# EAGLE design master (EAGLE 9.6.2)
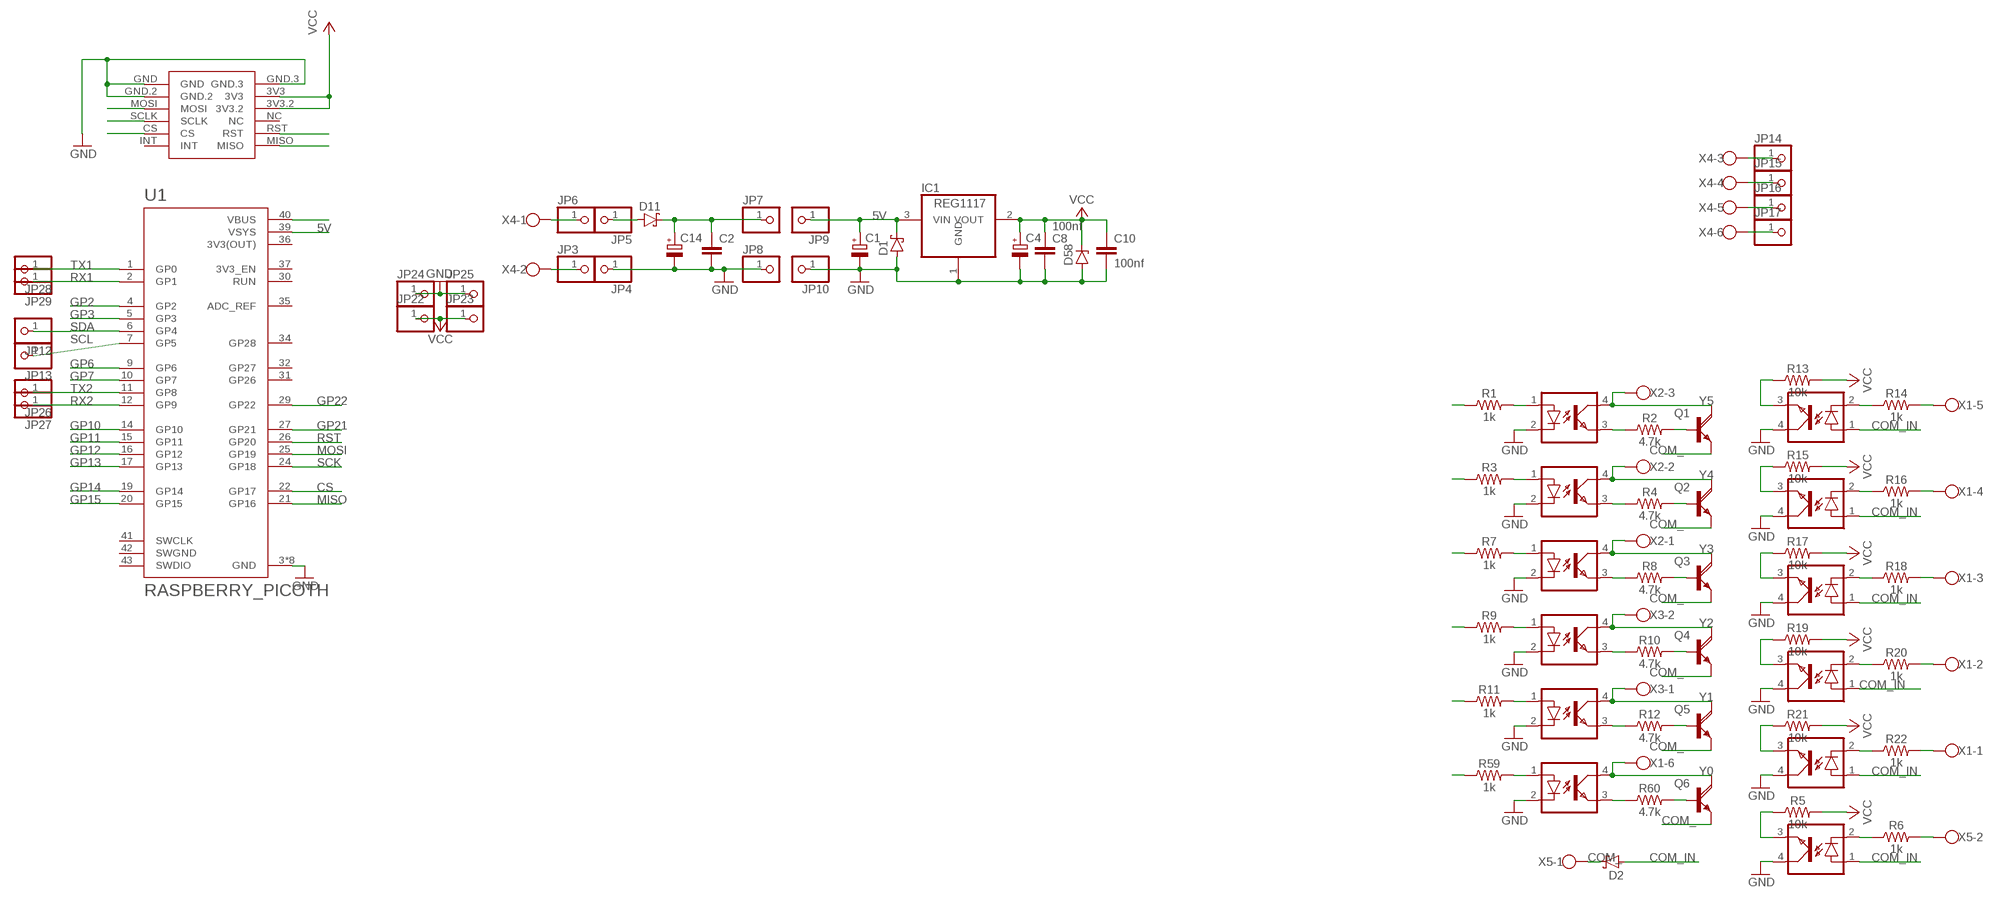
[diagram p0: schematic, sheet 1]

## Parts
C1  CPOL-EUE2.5-7  [E2,5-7]
C2  C-EUC1206K  [C1206K]
C4  CPOL-EUE2.5-7  [E2,5-7]
C8  100nf  39NF-0805-50V-10%  [0805]
C10  100nf  39NF-0805-50V-10%  [0805]
C14  CPOL-EUE2.5-7  [E2,5-7]
D1  SCHOTTKY-DIODESMD  [SMB]
D2  SCHOTTKY-DIODESMD  [SMB]
D11  SCHOTTKY-DIODESMD  [SMB]
D58  ZENER-DIODESOD80C  [SOD80C]
IC1  REG1117  [SOT223]
JP3  PINHD-1X1  [1X01]
JP4  PINHD-1X1  [1X01]
JP5  PINHD-1X1  [1X01]
JP6  PINHD-1X1  [1X01]
JP7  PINHD-1X1  [1X01]
JP8  PINHD-1X1  [1X01]
JP9  PINHD-1X1  [1X01]
JP10  PINHD-1X1  [1X01]
JP12  PINHD-1X1  [1X01]
JP13  PINHD-1X1  [1X01]
JP14  PINHD-1X1  [1X01]
JP15  PINHD-1X1  [1X01]
JP16  PINHD-1X1  [1X01]
JP17  PINHD-1X1  [1X01]
JP22  PINHD-1X1  [1X01]
JP23  PINHD-1X1  [1X01]
JP24  PINHD-1X1  [1X01]
JP25  PINHD-1X1  [1X01]
JP26  PINHD-1X1  [1X01]
JP27  PINHD-1X1  [1X01]
JP28  PINHD-1X1  [1X01]
JP29  PINHD-1X1  [1X01]
OK1  PC817  [DIL04]
OK2  PC817  [DIL04]
OK3  PC817  [DIL04]
OK4  PC817  [DIL04]
OK5  PC817  [DIL04]
OK6  PC817  [DIL04]
OK7  PC817  [DIL04]
OK8  PC817  [DIL04]
OK9  PC817  [DIL04]
OK10  PC817  [DIL04]
OK11  PC817  [DIL04]
OK14  PC817  [DIL04]
Q1  TIP120V  [TO220AV]
Q2  TIP120V  [TO220AV]
Q3  TIP120V  [TO220AV]
Q4  TIP120V  [TO220AV]
Q5  TIP120V  [TO220AV]
Q6  TIP120V  [TO220AV]
R1  1k  0.75OHM-0805-1/4W-1%  [0805]
R2  4.7k  0.75OHM-0805-1/4W-1%  [0805]
R3  1k  0.75OHM-0805-1/4W-1%  [0805]
R4  4.7k  0.75OHM-0805-1/4W-1%  [0805]
R5  10k  0.75OHM-0805-1/4W-1%  [0805]
R6  1k  0.75OHM-0805-1/4W-1%  [0805]
R7  1k  0.75OHM-0805-1/4W-1%  [0805]
R8  4.7k  0.75OHM-0805-1/4W-1%  [0805]
R9  1k  0.75OHM-0805-1/4W-1%  [0805]
R10  4.7k  0.75OHM-0805-1/4W-1%  [0805]
R11  1k  0.75OHM-0805-1/4W-1%  [0805]
R12  4.7k  0.75OHM-0805-1/4W-1%  [0805]
R13  10k  0.75OHM-0805-1/4W-1%  [0805]
R14  1k  0.75OHM-0805-1/4W-1%  [0805]
R15  10k  0.75OHM-0805-1/4W-1%  [0805]
R16  1k  0.75OHM-0805-1/4W-1%  [0805]
R17  10k  0.75OHM-0805-1/4W-1%  [0805]
R18  1k  0.75OHM-0805-1/4W-1%  [0805]
R19  10k  0.75OHM-0805-1/4W-1%  [0805]
R20  1k  0.75OHM-0805-1/4W-1%  [0805]
R21  10k  0.75OHM-0805-1/4W-1%  [0805]
R22  1k  0.75OHM-0805-1/4W-1%  [0805]
R59  1k  0.75OHM-0805-1/4W-1%  [0805]
R60  4.7k  0.75OHM-0805-1/4W-1%  [0805]
U1  RASPBERRY_PICOTH  [PICO-PKG-TH]
U$2  MINI_W5500  [MINI_W5500]
X1  W237-136  [W237-136]
X2  W237-103  [W237-103]
X3  W237-102  [W237-102]
X4  W237-136  [W237-136]
X5  W237-102  [W237-102]

## Nets
5V: C1.+ D1.C IC1.3(VIN) JP9.1 U1.39(VSYS)
COM_: D2.C Q1.E Q2.E Q3.E Q4.E Q5.E Q6.E X5.1
COM_IN: D2.A OK3.1(A) OK7.1(A) OK8.1(A) OK9.1(A) OK10.1(A) OK11.1(A)
CS: U1.22(GP17)
GND: C1.- C2.2 C4.- C8.2 C10.2 C14.- D1.A D58.A IC1.1(GND) JP4.1 JP8.1 JP10.1 JP24.1 JP25.1 OK1.2(C) OK2.2(C) OK3.4(COL) OK4.2(C) OK5.2(C) OK6.2(C) OK7.4(COL) OK8.4(COL) OK9.4(COL) OK10.4(COL) OK11.4(COL) OK14.2(C) U1.3(GND) U1.8(GND) U1.13(GND) U1.18(GND) U1.23(GND) U1.28(GND) U1.33(GND) U1.38(GND) U$2.GND U$2.GND.2 U$2.GND.3
GP2: U1.4(GP2)
GP3: U1.5(GP3)
GP6: U1.9(GP6)
GP7: U1.10(GP7)
GP10: U1.14(GP10)
GP11: U1.15(GP11)
GP12: U1.16(GP12)
GP13: U1.17(GP13)
GP14: U1.19(GP14)
GP15: U1.20(GP15)
GP21: U1.27(GP21)
GP22: U1.29(GP22)
MISO: U1.21(GP16)
MOSI: U1.25(GP19)
N$1: OK1.3(EMIT) R2.1
N$2: OK1.1(A) R1.2
N$3: Q1.B R2.2
N$4: OK2.3(EMIT) R4.1
N$5: OK2.1(A) R3.2
N$6: Q2.B R4.2
N$7: OK8.2(C) R16.1
N$8: OK9.2(C) R18.1
N$9: OK4.3(EMIT) R8.1
N$10: OK4.1(A) R7.2
N$11: Q3.B R8.2
N$12: OK5.3(EMIT) R10.1
N$13: OK5.1(A) R9.2
N$14: Q4.B R10.2
N$15: OK6.3(EMIT) R12.1
N$16: JP6.1 X4.1
N$17: D11.A JP5.1
N$18: U1.40(VBUS)
N$19: JP3.1 X4.2
N$20: OK6.1(A) R11.2
N$21: Q5.B R12.2
N$22: C2.1 C14.+ D11.C JP7.1
N$23: OK7.2(C) R14.1
N$24: OK10.2(C) R20.1
N$25: OK11.2(C) R22.1
N$26: OK3.2(C) R6.1
N$27: OK7.3(EMIT) R13.1
N$28: OK8.3(EMIT) R15.1
N$29: OK9.3(EMIT) R17.1
N$30: OK10.3(EMIT) R19.1
N$31: JP14.1 X4.3
N$32: JP15.1 X4.4
N$33: JP16.1 X4.5
N$34: JP17.1 X4.6
N$39: OK11.3(EMIT) R21.1
N$40: OK3.3(EMIT) R5.1
N$41: R14.2 X1.5
N$42: R16.2 X1.4
N$43: R18.2 X1.3
N$44: R20.2 X1.2
N$45: R22.2 X1.1
N$46: R6.2 X5.2
N$48: U$2.MOSI
N$49: U$2.SCLK
N$50: U$2.CS
N$51: U$2.RST
N$52: U$2.MISO
N$54: R1.1
N$55: R3.1
N$56: R7.1
N$57: R9.1
N$58: R11.1
N$59: R59.1
N$92: OK14.3(EMIT) R60.1
N$94: OK14.1(A) R59.2
N$97: Q6.B R60.2
RST: U1.26(GP20)
RX1: JP29.1 U1.2(GP1)
RX2: JP27.1 U1.12(GP9)
SCK: U1.24(GP18)
SCL: JP13.1 U1.7(GP5)
SDA: JP12.1 U1.6(GP4)
TX1: JP28.1 U1.1(GP0)
TX2: JP26.1 U1.11(GP8)
VCC: C4.+ C8.1 C10.1 D58.C IC1.2(VOUT) JP22.1 JP23.1 R5.2 R13.2 R15.2 R17.2 R19.2 R21.2 U$2.3V3 U$2.3V3.2
Y0: OK14.4(COL) Q6.C X1.6
Y1: OK6.4(COL) Q5.C X3.1
Y2: OK5.4(COL) Q4.C X3.2
Y3: OK4.4(COL) Q3.C X2.1
Y4: OK2.4(COL) Q2.C X2.2
Y5: OK1.4(COL) Q1.C X2.3
Unconnected: U1.30(RUN) U1.31(GP26) U1.32(GP27) U1.34(GP28) U1.35(ADC_REF) U1.37(3V3_EN) U1.41(SWCLK) U1.43(SWDIO) U$2.INT U$2.NC

## Power pins joined to a net without a drawn wire
3V3(OUT): U1.36(3V3(OUT))
SWGND: U1.42(SWGND)

## Library data of the parts
C1 C4 C14 = rcl:CPOL-EU: POLARIZED CAPACITOR, European symbol; SPICEPREFIX: C
C2 = rcl:C-EU: CAPACITOR, European symbol; SPICEPREFIX: C
C8 C10 = SparkFun-Capacitors:39NF: 39nF ceramic capacitors A capacitor is a passive two-terminal electrical component used to store electrical energy temporarily in an electric field.; PROD_ID: CAP-15816; VALUE: 39nF
D1 D2 D11 = diode:SCHOTTKY-DIODE: Schottky Diode
D58 = diode:ZENER-DIODE: Z-Diode
IC1 = burr-brown:REG1117: 800mA and 1A Low Dropout (LDO) Positive Regulator 1.8V, 2.5V, 2.85V, 3.3V, 5V, and Adj; MPN: REG1117; OC_FARNELL: 1097566; OC_NEWARK: 14P6981
JP3-JP10 JP12-JP17 JP22-JP29 = adafruit:PINHD-1X1: Pin header 1x1 for 0.1" spacing With round pins
OK1-OK11 OK14 = optocoupler:PC817: SHARP OPTO COUPLER; MPN: PC817X4J000F; OC_FARNELL: 9707727; OC_NEWARK: 97K7059
Q1-Q6 = rocketfarm:TIP120: NPN DARLINGTON TRANSISTOR
R1-R22 R59 R60 = SparkFun-Resistors:0.75OHM: 0.75Ω resistor A resistor is a passive two-terminal electrical component that implements electrical resistance as a circuit element. Resistors act to reduce current flow, and, at the same time, act to lower voltage levels within circuits. - Wikipedia; PROD_ID: RES-08474; VALUE: 0.75
U1 = RpiPico:RASPBERRY_PICO: Raspberry Pi Pico
U$2 = ethernet-w5500:MINI_W5500: MINI ETHERNET W5500, CREATE BY MIKROAVR.COM
X1 X4 = con-wago-500:W237-136: WAGO SCREW CLAMP; MPN: 237-136; OC_FARNELL: unknown; OC_NEWARK: 84K9151
X2 = con-wago-500:W237-103: WAGO SCREW CLAMP; MPN: 237-103; OC_FARNELL: unknown; OC_NEWARK: 18M7116
X3 X5 = con-wago-500:W237-102: WAGO SCREW CLAMP; MPN: 237-102; OC_FARNELL: unknown; OC_NEWARK: 70K9898

## Board
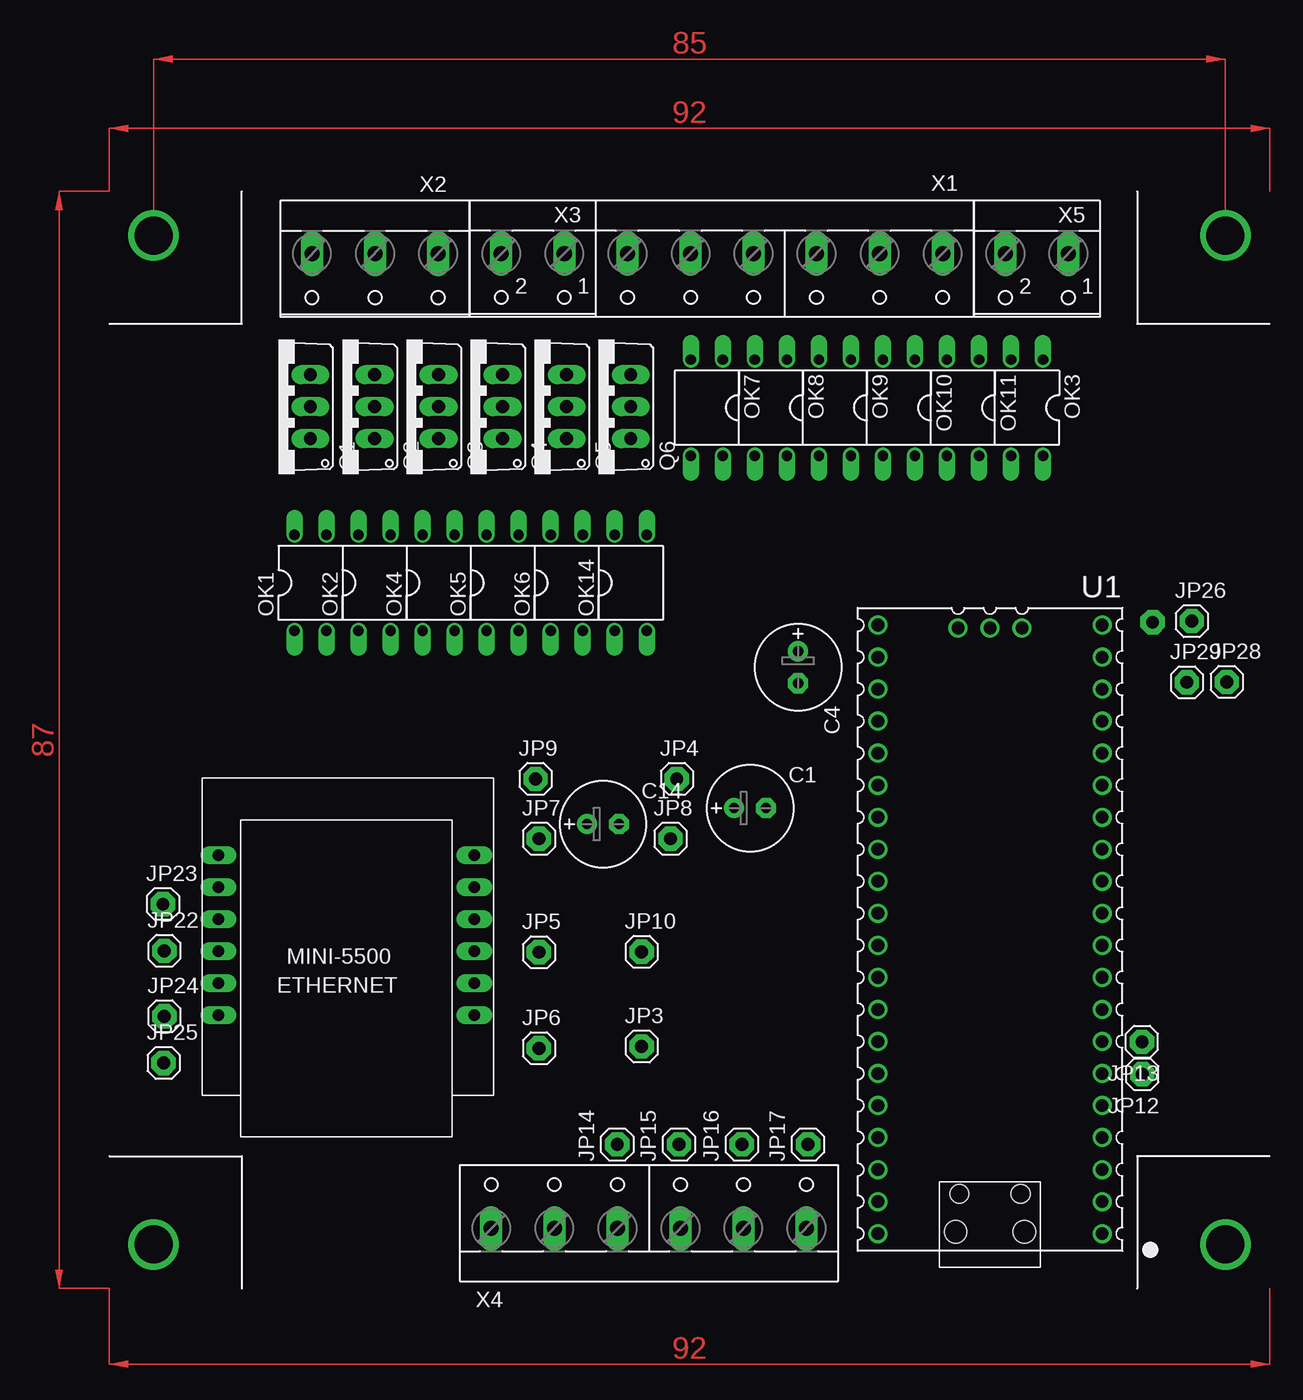
[diagram p1: board, top side]
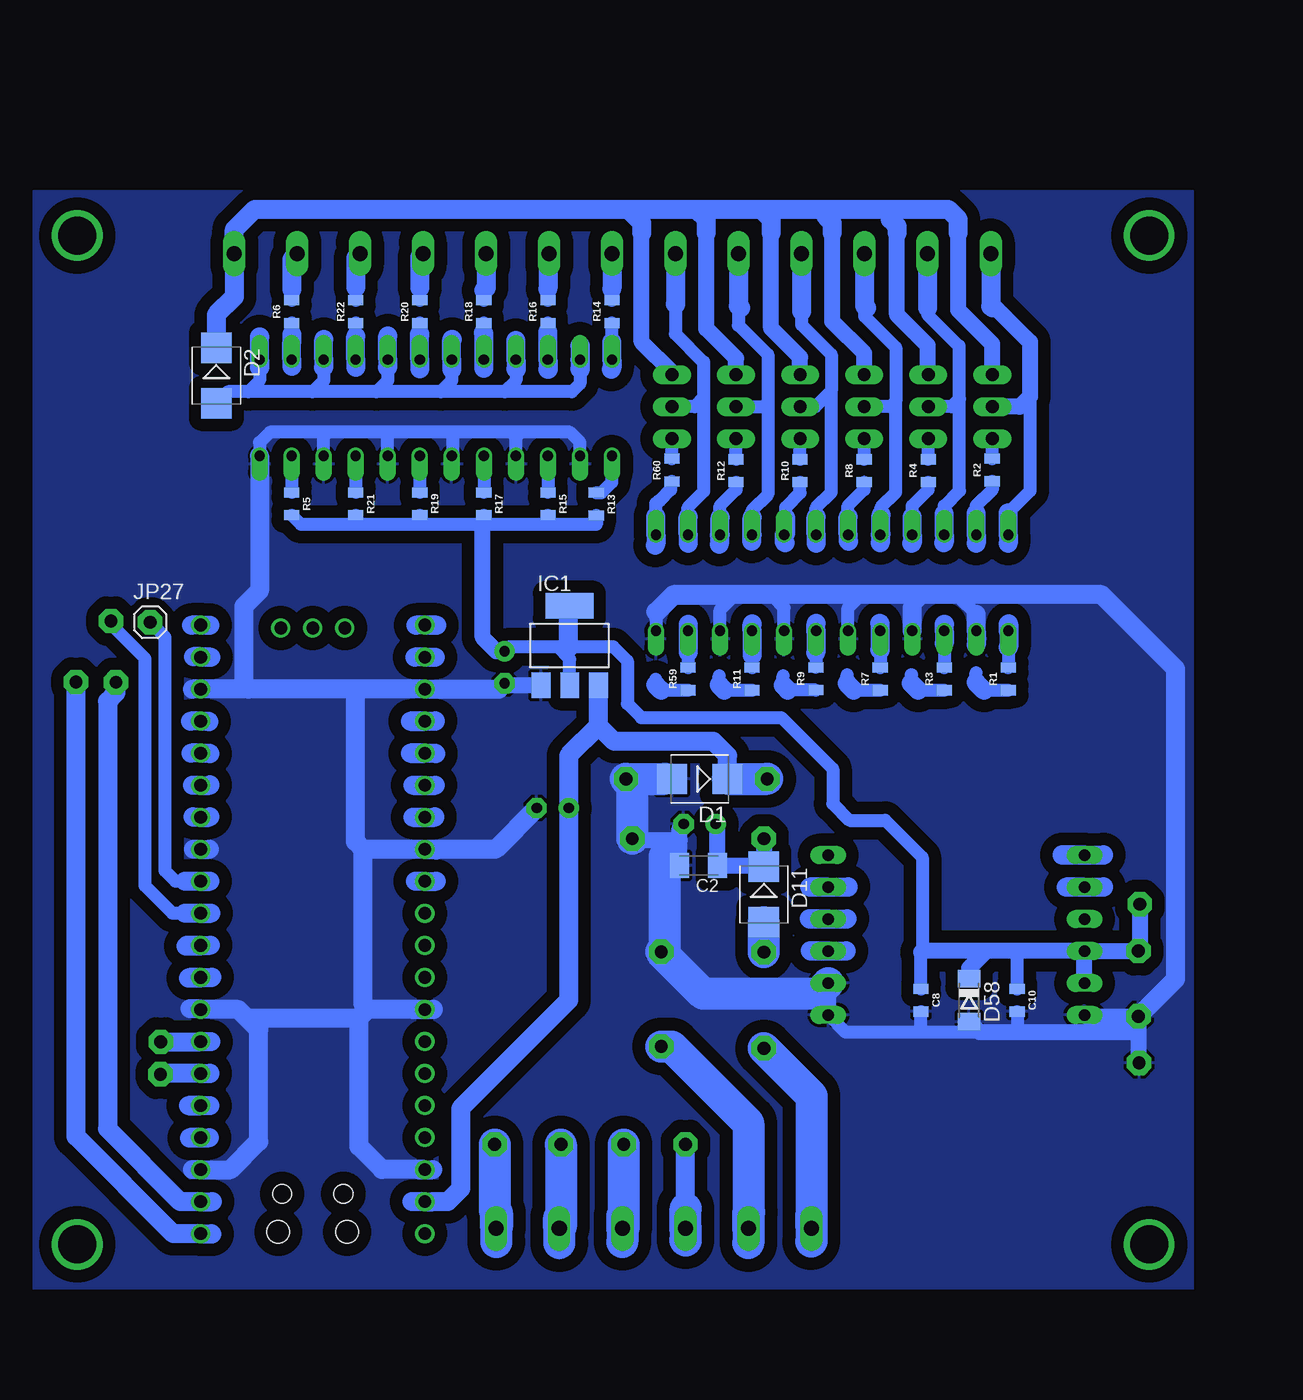
[diagram p2: board, bottom side, seen from below]

No outline drawn. Coordinates in mm, seen from the top.
Copper layers (1*16): Top 0.035mm / dielectric 1.5mm / Bottom 0.035mm
Design rules "default *": minimum track width 6mil, minimum drill 0.35mm, track to track 6mil, track to pad 6mil, pad to pad 6mil, via to via 6mil, smd to smd 6mil, copper to edge 10mil, drill to drill 6mil, minimum pad ring 10mil, minimum via ring 8mil, stop-mask expansion 4mil, vias tented up to drill 0mil, thermal gap 10mil

### Footprints (pad centres in the part's own frame; a part is rotated, then mirrored left to right if it is on the bottom)
E2,5-7 = drill 0.813 pad 1.6: + -1.27,0 | drill 0.813 pad 1.6 octagon: - 1.27,0
C1206K = smd 1.5 x 2: 1 -1.5,0; 2 1.5,0
0805 = smd 0.8 x 1.2: 1 -0.9,0; 2 0.9,0
SMB = smd 2.4 x 2.4: A 2.2,0; C -2.2,0
SOD80C = smd 1.4 x 1.8: A 1.7,0; C -1.7,0
SOT223 = smd 1.499 x 2.007: 1 -2.261,-3.15; 2 0.025,-3.15; 3 2.311,-3.15 | smd 3.81 x 2.007: 4 0,3.15
1X01 = drill 1.016 pad 1.93 octagon: 1 0,0
DIL04 = drill 0.813 offset: 1 -1.27,-3.81; 2 1.27,-3.81; 3 1.27,3.81; 4 -1.27,3.81
TO220AV = drill 1.016 long: B -2.54,-2.54; C 0,-2.54; E 2.54,-2.54
PICO-PKG-TH = drill 1: 1 -8.89,24.13; 2 -8.89,21.59; 3 -8.89,19.05; 4 -8.89,16.51; 5 -8.89,13.97; 6 -8.89,11.43; 7 -8.89,8.89; 8 -8.89,6.35; 9 -8.89,3.81; 10 -8.89,1.27; 11 -8.89,-1.27; 12 -8.89,-3.81; 13 -8.89,-6.35; 14 -8.89,-8.89; 15 -8.89,-11.43; 16 -8.89,-13.97; 17 -8.89,-16.51; 18 -8.89,-19.05; 19 -8.89,-21.59; 20 -8.89,-24.13; 21 8.89,-24.13; 22 8.89,-21.59; 23 8.89,-19.05; 24 8.89,-16.51; 25 8.89,-13.97; 26 8.89,-11.43; 27 8.89,-8.89; 28 8.89,-6.35; 29 8.89,-3.81; 30 8.89,-1.27; 31 8.89,1.27; 32 8.89,3.81; 33 8.89,6.35; 34 8.89,8.89; 35 8.89,11.43; 36 8.89,13.97; 37 8.89,16.51; 38 8.89,19.05; 39 8.89,21.59; 40 8.89,24.13; 41 -2.54,-23.9; 42 0,-23.9; 43 2.54,-23.9 | hole 1.8: -2.725,24; 2.725,24 | hole 1.5: -2.425,20.97; 2.425,20.97
MINI_W5500 = drill 0.914 long: 3V3 21.844,-8.89; 3V3.2 21.844,-11.43; CS 1.524,-16.51; GND 1.524,-6.35; GND.2 1.524,-8.89; GND.3 21.844,-6.35; INT 1.524,-19.05; MISO 21.844,-19.05; MOSI 1.524,-11.43; NC 21.844,-13.97; RST 21.844,-16.51; SCLK 1.524,-13.97
W237-136 = drill 1.194 long: 1 -12.5,-1.27; 2 -7.5,-1.27; 3 -2.5,-1.27; 4 2.5,-1.27; 5 7.5,-1.27; 6 12.5,-1.27
W237-103 = drill 1.194 long: 1 -5,-1.29; 2 0,-1.29; 3 5,-1.29
W237-102 = drill 1.194 long: 1 -2.5,-1.27; 2 2.5,-1.27

### Placement (x,y rotation side)
C1  50.8,38.1 0 top
C2  39.23,33.54 180 bottom
C4  54.61,49.26 270 top
C8  21.59,22.86 270 bottom
C10  13.97,22.86 270 bottom
C14  39.14,36.83 0 top
D1  39.14,40.41 180 bottom
D2  77.47,72.39 270 bottom
D11  34.06,31.25 270 bottom
D58  17.78,22.86 270 bottom
IC1  49.47,50.99 0 bottom
JP3  42.2,19.2 0 top
JP4  44.99,40.41 0 top
JP5  34.06,26.67 0 top
JP6  34.06,19.05 0 top
JP7  34.06,35.67 0 top
JP8  44.49,35.67 0 top
JP9  33.79,40.41 0 top
JP10  42.2,26.7 0 top
JP12  81.91,16.99 180 top
JP13  81.88,19.56 180 top
JP14  40.27,11.43 90 top
JP15  45.17,11.43 90 top
JP16  50.15,11.43 90 top
JP17  55.4,11.43 90 top
JP22  4.35,26.78 0 top
JP23  4.24,30.48 0 top
JP24  4.35,21.59 0 top
JP25  4.3,17.89 0 top
JP26  85.83,52.93 0 top
JP27  82.73,52.84 0 bottom
JP28  88.6,48.1 0 top
JP29  85.44,48.07 0 top
OK1  15.94,55.96 0 top
OK2  21.02,55.96 0 top
OK3  72.77,69.85 180 top
OK4  26.1,55.96 0 top
OK5  31.18,55.96 0 top
OK6  36.26,55.96 0 top
OK7  47.37,69.85 180 top
OK8  52.45,69.85 180 top
OK9  57.53,69.85 180 top
OK10  62.61,69.85 180 top
OK11  67.69,69.85 180 top
OK14  41.34,55.96 0 top
Q1  13.4,69.93 90 top
Q2  18.48,69.93 90 top
Q3  23.56,69.93 90 top
Q4  28.64,69.93 90 top
Q5  33.72,69.93 90 top
Q6  38.8,69.93 90 top
R1  14.67,48.34 90 bottom
R2  15.95,64.91 90 bottom
R3  19.75,48.34 90 bottom
R4  21.02,64.85 90 bottom
R5  71.5,62.23 270 bottom
R6  71.5,77.47 90 bottom
R7  24.83,48.34 90 bottom
R8  26.1,64.85 90 bottom
R9  29.93,48.36 90 bottom
R10  31.18,64.85 90 bottom
R11  34.99,48.34 90 bottom
R12  36.26,64.85 90 bottom
R13  47.34,62.2 270 bottom
R14  46.1,77.47 90 bottom
R15  51.18,62.23 270 bottom
R16  51.18,77.47 90 bottom
R17  56.26,62.23 270 bottom
R18  56.26,77.47 90 bottom
R19  61.34,62.23 270 bottom
R20  61.34,77.47 90 bottom
R21  66.42,62.23 270 bottom
R22  66.42,77.47 90 bottom
R59  40.07,48.34 90 bottom
R60  41.35,64.9 90 bottom
U1  69.83,28.48 180 top
U$2  30.47,15.33 180 top
X1  53.58,80.8 180 top
X2  21.07,80.77 180 top
X3  33.57,80.8 180 top
X4  42.78,6.04 0 top
X5  73.55,80.79 180 top

### Tracks (layer width: path | path; a pad name or v marks a point on that pad's centre or on a via)
5V
  Bottom 1.5: 61.97,6.88 61.96,6.89 U1.39 60.3,6.89 | 60.3,6.89 60.29,6.88 | D1.C 36.94,42.26 38.07,43.39 45.93,43.39 47.16,44.62 | 47.16,44.62 IC1.3 | 47.16,44.62 49.53,42.26 C1.+ 49.53,22.86 58.1,14.28 58.1,7.91 59.12,6.89 60.3,6.89
  Bottom 2.54: D1.C JP9.1
COM_
  Bottom 1.27: Q1.E 15.94,74.9 18.63,77.59 18.63,83.7 | Q2.E 21.06,72.51 21.06,74.79 23.49,77.22 23.49,84.24 | Q3.E 26.1,74.16 28.62,76.68 28.62,83.7 | Q4.E 31.18,73.84 33.48,76.14 33.48,84.78 | Q5.E 36.26,73.76 38.61,76.11 38.61,83.7 | Q6.E 41.34,72.66 43.74,75.06 43.74,84.51
  Bottom 1.5: 44.82,85.59 43.74,84.51 43.74,83.7 | 44.82,85.59 74.43,85.59 76.05,83.97 X5.1 76.05,78.63 77.47,77.21 D2.C | 44.82,85.59 39.42,85.59 | 39.42,85.59 34.29,85.59 | 34.29,85.59 29.16,85.59 | 29.16,85.59 24.03,85.59 | 24.03,85.59 19.44,85.59 18.63,84.78 18.63,83.7 | 24.03,85.59 24.03,84.78 23.49,84.24 23.49,83.7 | 29.16,85.59 29.16,85.05 28.62,84.51 28.62,83.7 | 34.29,85.59 33.48,84.78 33.48,83.7 | 39.42,85.59 38.61,84.78 38.61,83.7
COM_IN
  Bottom 1.016: OK7.1 48.64,71.75 49.27,71.12 54.61,71.12 | D2.A 76.54,71.12 74.93,71.12 | 54.61,71.12 59.69,71.12 | 59.69,71.12 64.77,71.12 | 64.77,71.12 69.85,71.12 | 69.85,71.12 74.93,71.12 | OK3.1 74.04,72.01 74.93,71.12 | OK11.1 68.96,72.01 69.85,71.12 | OK10.1 63.88,72.01 64.77,71.12 | OK9.1 58.8,72.01 59.69,71.12 | OK8.1 53.72,72.01 54.61,71.12
  Bottom 1.5: OK7.1 48.6,73.7 48.6,74.79 48.64,74.75 OK7.1 | OK7.1 48.64,72.94 48.6,72.9 | 53.73,75.19 53.72,75.19 OK8.1 53.72,72.92 53.7,72.9 | 58.78,75.28 58.8,75.25 OK9.1 58.8,72.88 58.81,72.87 | 63.88,75.55 63.88,75.54 OK10.1 63.88,73.09 63.91,73.06 | 68.98,73.06 68.96,73.09 OK11.1 68.96,75.25 | 74.03,75.47 74.04,75.46 OK3.1 74.04,73.04 74.03,73.03
CS
  Bottom 1.5: 60.1,50.06 60.11,50.07 U1.22 61.74,50.07 61.75,50.06
GND
  Bottom 1.016: OK7.4 48.64,67.11 49.44,67.91 53.33,67.91 | 53.33,67.91 53.76,67.47 53.76,66.08 OK8.4 | 53.33,67.91 58.7,67.91 | 58.7,67.91 63.8,67.91 | 63.8,67.91 68.61,67.91 | 68.61,67.91 73.22,67.91 74.04,67.09 OK3.4 | OK9.4 58.7,66.14 58.7,67.91 | OK10.4 63.88,67.83 63.8,67.91 | OK11.4 68.96,67.55 68.61,67.91 | 17.21,53.47 18.58,54.84 21.44,54.84 | 26.46,54.89 33.37,54.89 33.26,54.78 | 33.26,54.78 36.56,54.78 36.64,54.7 | 36.64,54.7 41.12,54.7 42.61,53.21 | 42.61,53.65 42.61,53.21 | OK14.2 42.61,53.13 42.61,53.21 | OK6.2 37.53,53.81 36.64,54.7 | OK5.2 32.45,53.97 33.26,54.78 | OK4.2 27.37,53.98 26.46,54.89 | 26.46,54.89 26.41,54.95 21.33,54.95 21.44,54.84 | 22.29,53.98 21.44,54.84 | C10.2 13.97,20.39 13.9,20.32 | 16.94,20.32 21.27,20.32 | C8.2 21.59,20.64 21.27,20.32 | 21.27,20.32 27.59,20.32 U$2.GND
  Bottom 1.27: C2.2 40.73,35.56 | 40.73,35.56 40.73,36.51 C14.- | JP8.1 44.38,35.56 41.91,35.56 | 41.91,35.56 40.73,35.56 | 41.91,40.41 D1.A | IC1.1 54.46,47.84 C4.- 55.07,47.53 | 41.91,34.29 41.91,35.56 | U$2.GND U$2.GND.2 | U$2.GND.3 8.54,21.59 JP24.1 4.35,20.32 | 4.35,20.32 4.35,17.94 JP25.1 | 4.35,20.32 13.9,20.32 16.94,20.32 D58.A
  Bottom 1.5: 66.45,47.53 U1.23 55.07,47.53 | 66.45,47.53 74.93,47.53 | 74.93,47.53 U1.18 79.37,47.53 79.38,47.52 | U1.28 65.83,34.83 | 66.45,47.53 66.45,35.45 65.83,34.83 | 75.06,21.46 74.11,20.52 74.11,11.66 76.35,9.43 U1.3 79.35,9.43 79.35,9.42 | 75.06,21.46 75.72,22.13 U1.8 78.78,22.19 79.57,22.19 | 79.3,34.83 U1.13 78.06,34.83 78.03,34.86 | U1.28 60.13,34.83 60.05,34.75 | U1.33 61.9,22.13 61.91,22.14 U1.33 | U1.33 60.27,22.13 60.26,22.14 | U1.38 60.96,9.45 61.53,9.45 | 61.53,9.45 61.53,9.42 60.32,9.42 | C1.- 55.34,34.83 U1.28 | U1.33 65.49,22.13 | 65.83,34.83 65.83,22.46 65.49,22.13 | 75.06,21.46 66.16,21.46 | 66.16,21.46 65.49,22.13 | 61.53,9.45 64.34,9.45 66.16,11.27 66.16,21.46 | OK3.4 74.04,55.34 75.3,54.08 75.3,47.9 74.93,47.53 | JP24.1 1.4,24.54 1.4,49.14 7.29,55.03 41.23,55.03 42.61,53.65 | 17.21,53.47 OK1.2 17.21,51.05 17.23,51.03 | OK2.2 22.29,53.98
  Bottom 2.54: U$2.GND.2 29.78,23.38 38.88,23.38 JP10.1 41.91,26.99 41.91,34.29 | JP8.1 44.49,39.91 JP4.1 41.91,40.41
  pour Bottom (isolate 1): 0,0 0,87 92,87 92,86.5 92,0
GP2
  Bottom 1.5: U1.4 79.59,11.97 79.62,11.93 78.76,11.93 U1.4 | U1.4 78.03,11.96
GP3
  Bottom 1.5: U1.5 79.69,14.51 79.7,14.5 U1.5 | U1.5 77.99,14.51 77.98,14.5
GP6
  Bottom 1.5: U1.9 79.63,24.67 79.68,24.62 78.77,24.62 U1.9 | U1.9 77.85,24.67 77.84,24.68
GP7
  Bottom 1.5: U1.10 79.82,27.21 79.87,27.16 78.77,27.16 U1.10 | U1.10 77.95,27.21 77.95,27.22
GP10
  Bottom 1.5: 79.33,37.42 79.27,37.37 U1.14 78.06,37.37 78,37.42
GP11
  Bottom 1.5: 79.38,39.91 U1.15 78,39.91 77.98,39.93
GP12
  Bottom 1.5: 79.49,42.44 79.48,42.45 U1.16 78.01,42.45 77.98,42.42
GP13
  Bottom 1.5: 79.52,44.98 79.51,44.99 U1.17 78.09,44.99 78.06,44.95
GP14
  Bottom 1.5: U1.19 77.93,50.07 77.92,50.06 78.71,50.06 U1.19 | U1.19 78.76,50.11 79.3,50.11
GP15
  Bottom 1.5: 77.98,52.6 77.99,52.61 U1.20 79.42,52.61 79.43,52.6
GP21
  Bottom 1.5: U1.27 61.91,37.37 U1.27 | U1.27 60.15,37.37 60.13,37.4
GP22
  Bottom 1.5: U1.29 61.67,32.29 61.7,32.32 60.97,32.32 U1.29 | U1.29 60.05,32.29
MISO
  Bottom 1.5: U1.21 60.01,52.61 59.99,52.6 60.93,52.6 U1.21 | U1.21 61.63,52.61 61.64,52.6
MOSI
  Bottom 1.5: U1.25 62.09,42.45 62.1,42.44 U1.25 | U1.25 60.11,42.45 60.08,42.42
N$1
  Bottom 1.016: R2.1 15.95,63.34 17.21,62.08 17.21,61.48
  Bottom 1.5: 17.21,61.48 OK1.3 17.21,59.09 17.23,59.08
N$2
  Bottom 1.016: 14.67,50.84 R1.2
  Bottom 1.5: OK1.1 14.67,52.67 14.63,52.7 14.63,50.88 14.67,50.84
N$3
  Bottom 1.016: R2.2 Q1.B
N$4
  Bottom 1.016: 22.29,61.21 22.29,62.09 21.02,63.35 R4.1
  Bottom 1.5: 22.29,61.21 OK2.3 22.29,59.12 22.33,59.08
N$5
  Bottom 1.016: 19.75,51.16 R3.2
  Bottom 1.5: 19.74,52.68 19.75,52.66 OK2.1 19.75,51.16
N$6
  Bottom 1.016: R4.2 Q2.B
N$7
  Bottom 1.016: OK8.2 R16.1
  Bottom 1.5: 51.19,75.84 51.18,75.83 OK8.2 51.18,72.89 51.16,72.87
N$8
  Bottom 1.016: OK9.2 R18.1
  Bottom 1.5: 56.3,75.76 56.26,75.73 OK9.2 56.27,72.95
N$9
  Bottom 1.016: R8.1 26.11,63.34 27.37,62.08 27.37,61.21
  Bottom 1.5: 27.37,61.21 OK4.3 27.37,59.28 27.32,59.24
N$10
  Bottom 1.016: 24.83,50.62 R7.2
  Bottom 1.5: OK4.1 24.83,52.72 24.87,52.76 24.87,50.66 24.83,50.62
N$11
  Bottom 1.016: R8.2 Q3.B
N$12
  Bottom 1.016: R10.1 31.18,63.1 32.32,61.97 32.32,61.1
  Bottom 1.5: 32.32,61.1 32.32,59.9 OK5.3 32.45,59.21 32.37,59.13
N$13
  Bottom 1.016: 29.93,50.41 R9.2
  Bottom 1.5: 29.89,52.76 29.91,52.74 OK5.1 29.93,52.13 29.93,50.41
N$14
  Bottom 1.016: R10.2 Q4.B
N$15
  Bottom 1.016: R12.1 36.26,63.34 37.53,62.07 37.53,61.16
  Bottom 1.5: 37.53,61.16 OK6.3 37.58,59.72 37.58,59.02
N$16
  Bottom 2.54: X4.1 30.28,5.98 30.27,5.99 | X4.1 30.28,3.77 30.32,3.73 | JP6.1 30.28,15.27 X4.1
N$17
  Bottom 2.54: JP5.1 D11.A
N$19
  Bottom 2.54: X4.2 35.28,6 35.23,6.05 | X4.2 35.28,3.6 35.29,3.59 | JP3.1 41.37,19.2 35.28,13.11 X4.2
N$20
  Bottom 1.016: 34.99,50.22 R11.2
  Bottom 1.5: 34.97,52.7 34.99,52.68 OK6.1 34.99,50.22
N$21
  Bottom 1.016: R12.2 Q5.B
N$22
  Bottom 1.27: JP7.1 D11.C 34.15,33.54 35.56,33.54 C2.1 37.73,36.69 C14.+
N$23
  Bottom 1.016: 46.1,75.06 R14.1
  Bottom 1.5: 46.17,72.9 46.1,72.97 OK7.2 46.1,75.06
N$24
  Bottom 1.016: OK10.2 R20.1
  Bottom 1.5: 61.32,75.71 61.37,75.65 61.37,75.6 61.34,75.57 OK10.2 61.34,72.95 61.32,72.93
N$25
  Bottom 1.016: OK11.2 R22.1
  Bottom 1.5: 66.42,75.52 OK11.2 66.42,73.06
N$26
  Bottom 1.016: OK3.2 R6.1
  Bottom 1.5: 71.5,73.14 71.5,73.15 OK3.2 71.5,75.06 71.47,75.09 71.47,75.68
N$27
  Bottom 1.016: R13.1 46.93,63.1 46.1,63.93 OK7.3
N$28
  Bottom 1.016: OK8.3 R15.1
N$29
  Bottom 1.016: OK9.3 R17.1
N$30
  Bottom 1.016: OK10.3 R19.1
N$31
  Bottom 1.5: 40.27,6.35 JP14.1
  Bottom 2.54: 40.27,6.35 X4.3 40.28,3.83 40.26,3.81
N$32
  Bottom 2.54: X4.4 45.28,5.75 | X4.4 45.28,3.7 | JP15.1 45.17,4.88 X4.4
N$33
  Bottom 2.54: X4.5 50.28,5.64 50.27,5.64 | X4.5 50.28,3.6 50.27,3.59 | JP16.1 50.15,4.9 X4.5
N$34
  Bottom 2.54: X4.6 55.28,5.96 55.22,6.02 | 55.22,6.02 55.22,4.83 X4.6 | X4.6 55.28,3.71 55.27,3.7 | JP17.1 55.4,6.21 55.22,6.02
N$35  (via drill 3)
  other vias: 3.5,83.5
N$36  (via drill 3)
  other vias: 3.5,3.5
N$37  (via drill 3)
  other vias: 88.5,83.5
N$38  (via drill 3)
  other vias: 88.5,3.5
N$39
  Bottom 1.016: OK11.3 R21.1
N$40
  Bottom 1.016: OK3.3 R5.1
N$41
  Bottom 1.016: 46.1,79.27 R14.2
  Bottom 1.5: X1.5 46.1,82.05 46.1,79.27
N$42
  Bottom 1.016: 51.18,79.27 R16.2
  Bottom 1.5: X1.4 51.18,81.97 51.18,79.27
N$43
  Bottom 1.016: 56.26,79.16 R18.2
  Bottom 1.5: X1.3 56.08,79.34 56.26,79.16
N$44
  Bottom 1.016: 61.34,79.35 R20.2
  Bottom 1.5: X1.2 61.34,81.81 61.34,79.35
N$45
  Bottom 1.016: 66.42,79.41 R22.2
  Bottom 1.5: X1.1 66.42,81.73 66.42,79.41
N$46
  Bottom 1.016: 71.5,79.22 R6.2
  Bottom 1.5: X5.2 71.5,81.61 71.5,79.22
N$47
  Bottom 1.5: 49.53,50.8 49.53,53.34
N$48
  Bottom 1.5: U$2.MOSI 30.35,26.76 30.38,26.78 28.97,26.78 U$2.MOSI | U$2.MOSI 27.54,26.76 27.51,26.78
N$49
  Bottom 1.5: U$2.SCLK 30.43,29.3 30.46,29.32 28.97,29.32 U$2.SCLK | U$2.SCLK 27.48,29.3 27.46,29.32
N$50
  Bottom 1.5: U$2.CS 30.42,31.84 30.43,31.83 U$2.CS | U$2.CS 27.37,31.84 27.35,31.86
N$51
  Bottom 1.5: U$2.RST 10.09,31.84 10.1,31.83 U$2.RST | U$2.RST 7.12,31.84 7.1,31.86
N$52
  Bottom 1.5: U$2.MISO 10.4,34.38 10.42,34.4 8.64,34.4 U$2.MISO | U$2.MISO 7.12,34.38 7.1,34.4
N$54
  Bottom 1.016: R1.1 16.61,47.44 | 17.23,48.06 17.23,48.82
  Bottom 1.5: 16.61,47.44 17.23,48.06
N$55
  Bottom 1.016: R3.1 21.82,47.44 | 22.33,48.68 22.36,48.65 22.36,47.98
  Bottom 1.5: 21.82,47.44 22.36,47.98
N$56
  Bottom 1.016: R7.1 26.92,47.44 | 27.46,47.98 27.46,48.65
  Bottom 1.5: 26.92,47.44 27.46,47.98
N$57
  Bottom 1.016: R9.1 32.15,47.46 | 32.53,47.84 32.53,48.57
  Bottom 1.5: 32.15,47.46 32.53,47.84
N$58
  Bottom 1.016: R11.1 37.18,47.44 | 37.61,47.87 37.61,48.57
  Bottom 1.5: 37.18,47.44 37.61,47.87
N$59
  Bottom 1.016: R59.1 42.2,47.44 | 42.63,47.87 42.63,48.33
  Bottom 1.5: 42.2,47.44 42.63,47.87
N$92
  Bottom 1.016: R60.1 41.45,63.91 41.45,63.34 42.31,62.48 42.39,62.48 42.61,62.26 42.61,61.24
  Bottom 1.5: 42.61,61.24 OK14.3 42.61,59.02 42.69,58.94
N$94
  Bottom 1.016: 40.07,50.46 R59.2
  Bottom 1.5: OK14.1 40.04,52.18 40.04,52.68 40.07,52.65 40.07,50.46
N$97
  Bottom 1.016: R60.2 Q6.B
RST
  Bottom 1.5: U1.26 61.88,39.91 U1.26 | U1.26 60.11,39.91 60.1,39.91
RX1
  Bottom 1.5: JP29.1 85.44,47.23 86.1,46.57 86.1,12.66 80.33,6.89 U1.2 77.81,6.89 77.79,6.91
RX2
  Bottom 1.016: 79.95,32.29 80.7,32.29 81.54,33.13 81.54,51.65 JP27.1
  Bottom 1.5: U1.12 77.98,32.29 79.94,32.29 79.95,32.29
SCK
  Bottom 1.5: U1.24 62.09,44.99 62.1,44.98 U1.24 | U1.24 60.12,44.99 60.1,45.01
SCL
  Bottom 1.5: JP13.1 78.75,19.56 U1.7 77.94,19.59 77.92,19.57
SDA
  Bottom 1.5: JP12.1 81.85,17.05 U1.6 77.99,17.05 77.98,17.06
TX1
  Bottom 1.5: JP28.1 88.6,12.06 80.89,4.35 U1.1 77.87,4.35 77.84,4.32
TX2
  Bottom 1.016: 79.95,29.75 80.94,29.75 83.13,31.94 83.13,49.95 85.83,52.65 JP26.1
  Bottom 1.5: U1.11 77.9,29.75 77.89,29.75 79.94,29.75 79.95,29.75
VCC
  Bottom 1.016: R13.2 47.34,60.59 51.06,60.59 | R5.2 70.76,60.59 66.26,60.59 | 51.06,60.59 56.24,60.59 | 56.24,60.59 61.05,60.59 | 61.05,60.59 66.26,60.59 | R21.2 66.42,60.75 66.26,60.59 | R19.2 61.34,60.88 61.05,60.59 | R17.2 56.26,60.61 56.24,60.59 | R15.2 51.18,60.71 51.06,60.59 | C4.+ 54.24,50.9 50.44,50.9 | IC1.2 49.45,49.91 50.44,50.9 | C10.1 13.97,26.72 13.93,26.76 | C8.1 21.59,26.67 | 50.44,50.9 46.01,50.9 44.87,49.76 44.87,46.39 43.77,45.28 32.67,45.28 28.59,41.2 28.59,38.45 27.27,37.12 24.43,37.12 21.5,34.19 21.5,26.76
  Bottom 1.27: C4.+ 55.26,50.53 56.35,51.62 56.35,60.48 56.24,60.59 | U$2.3V3 U$2.3V3.2 | U$2.3V3.2 8.61,26.78 JP22.1 4.24,26.89 JP23.1 | U$2.3V3.2 13.93,26.76 16.42,26.76 | 16.42,26.76 17.78,25.4 D58.C | 16.42,26.76 21.5,26.76 21.59,26.67
Y0
  Bottom 1.016: 41.08,78.07 41.08,75.72 38.83,73.47 38.83,70.63 | Q6.C 39.53,69.93 38.83,70.63 | 38.83,70.63 38.83,63.21 40.07,61.96 40.07,61.21
  Bottom 1.5: X1.6 41.08,78.07 41.04,78.03 | 40.07,61.21 OK14.4 40.07,59.13 40.04,59.1
Y1
  Bottom 1.016: 36.07,77.92 36.07,76.38 33.75,74.06 33.75,70.28 | 34.99,61.16 34.99,61.72 33.75,62.96 33.75,70.28 | Q5.C 34.1,69.93 33.75,70.28
  Bottom 1.5: X3.1 36.07,77.92 35.91,77.76 | 34.99,61.16 OK6.4 35.02,59.74 35.02,59.27
Y2
  Bottom 1.016: 31.07,77.51 31.07,76.43 28.7,74.06 28.7,71.2 | Q4.C 29.97,69.93 28.7,71.2 | 29.91,61.18 29.91,61.92 28.7,63.13 28.7,71.2
  Bottom 1.5: X3.2 31.07,77.51 31.05,77.49 | 29.91,61.18 OK5.4 29.92,59.1
Y3
  Bottom 1.016: 26.07,77.91 26.07,77.1 23.6,74.63 23.6,70.36 | Q3.C 24.03,69.93 23.6,70.36 | 23.6,70.36 23.6,63.13 24.76,61.97 24.76,61.34
  Bottom 1.5: X2.1 26.07,77.91 25.92,77.76 | 24.76,61.34 24.76,59.84 OK4.4 24.83,59.15 24.81,59.13
Y4
  Bottom 1.016: 21.07,77.77 21.07,77.23 18.58,74.74 18.58,70.52 | Q2.C 19.17,69.93 18.58,70.52 | 18.58,70.52 18.55,70.55 18.55,63.26 19.75,62.06 19.75,61.42
  Bottom 1.5: X2.2 21.07,77.77 21.06,77.76 | 19.75,61.42 OK2.4 19.75,59.17 19.79,59.13
Y5
  Bottom 1.016: 12.96,70.74 12.96,63.24 14.67,61.53
  Bottom 1.27: 15.93,77.76 15.66,77.76 12.96,75.06 12.96,70.74 13.77,69.93 Q1.C
  Bottom 1.5: X2.3 16.07,77.9 15.93,77.76 | 14.67,61.53 OK1.4 14.67,59.09 14.69,59.08
(copper drawn outside any net)
  shapes: Top area x4